# Altium schematic sheet connectors_new.SchDoc
size A4
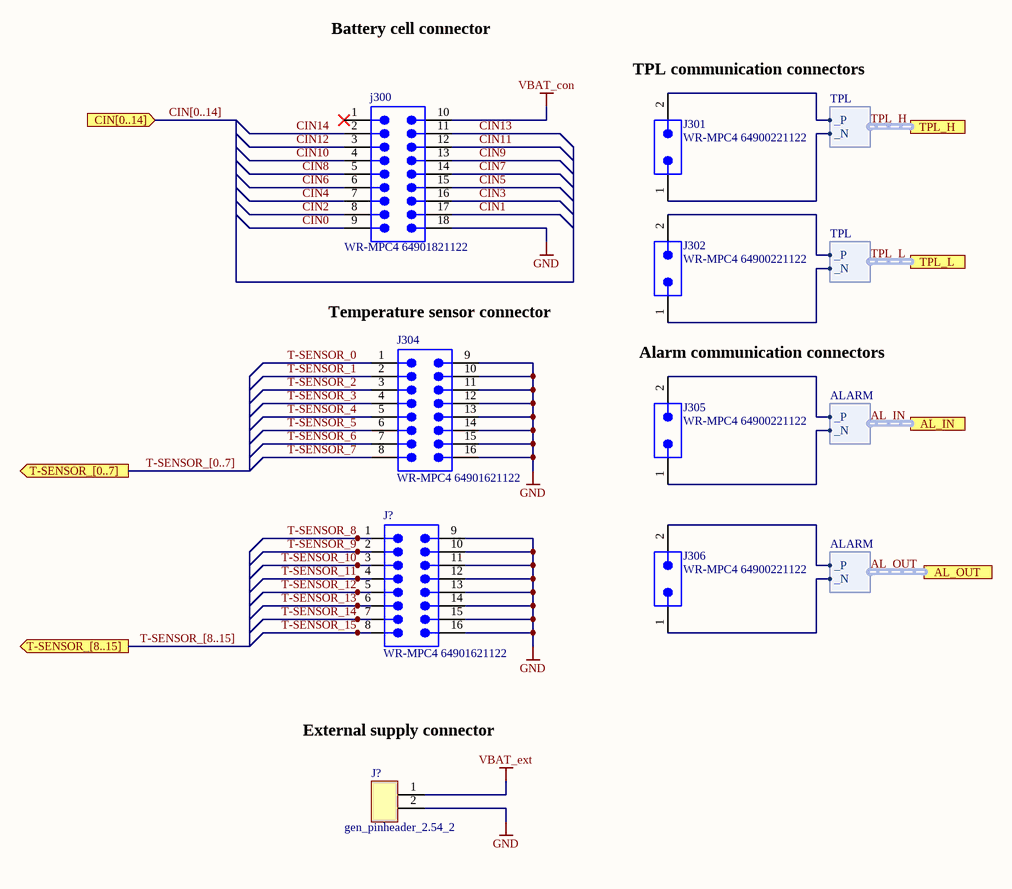
[diagram p0: connectors_new.SchDoc]

## Parts
(Parts that share a designator on the sheet are numbered #1, #2 ... from top to bottom, then left to right.)
j300  WR-MPC4 64901821122  [64901821122]
J301  WR-MPC4 64900221122  [64900221122]
J302  WR-MPC4 64900221122  [64900221122]
J304  WR-MPC4 64901621122  [64901621122]
J305  WR-MPC4 64900221122  [64900221122]
J306  WR-MPC4 64900221122  [64900221122]
J?#1  WR-MPC4 64901621122  [64901621122]
J?#2  gen_pinheader_2.54_2  [Pinheader_2.54_2]

## Ports
AL_IN (harness ALARM), AL_OUT (harness ALARM), CIN[0..14] (in), T-SENSOR_[0..7] (out), T-SENSOR_[8..15] (out), TPL_H (harness TPL), TPL_L (harness TPL)

## Harnesses
TPL: _P, _N
ALARM: _P, _N

## Nets
GND: j300.18 J304.9 J304.10 J304.11 J304.12 J304.13 J304.14 J304.15 J304.16 J?#1.9 J?#1.10 J?#1.11 J?#1.12 J?#1.13 J?#1.14 J?#1.15 J?#1.16 J?#2.2
VBAT_con: j300.10
VBAT_ext: J?#2.1
AL_IN._N: J305.1 ; port AL_IN._N
AL_IN._P: J305.2 ; port AL_IN._P
AL_OUT._N: J306.1 ; port AL_OUT._N
AL_OUT._P: J306.2 ; port AL_OUT._P
CIN0: j300.9
CIN1: j300.17
CIN2: j300.8
CIN3: j300.16
CIN4: j300.7
CIN5: j300.15
CIN6: j300.6
CIN7: j300.14
CIN8: j300.5
CIN9: j300.13
CIN10: j300.4
CIN11: j300.12
CIN12: j300.3
CIN13: j300.11
CIN14: j300.2
T-SENSOR_0: J304.1
T-SENSOR_1: J304.2
T-SENSOR_2: J304.3
T-SENSOR_3: J304.4
T-SENSOR_4: J304.5
T-SENSOR_5: J304.6
T-SENSOR_6: J304.7
T-SENSOR_7: J304.8
T-SENSOR_8: J?#1.1
T-SENSOR_9: J?#1.2
T-SENSOR_10: J?#1.3
T-SENSOR_11: J?#1.4
T-SENSOR_12: J?#1.5
T-SENSOR_13: J?#1.6
T-SENSOR_14: J?#1.7
T-SENSOR_15: J?#1.8
TPL_H._N: J301.1 ; port TPL_H._N
TPL_H._P: J301.2 ; port TPL_H._P
TPL_L._N: J302.1 ; port TPL_L._N
TPL_L._P: J302.2 ; port TPL_L._P

Not connected (* = marked no-connect by the designer): j300 1*

## Buses and harness runs
bus CIN[0..14] = port CIN[0..14]
bus T-SENSOR_[0..7] = port T-SENSOR_[0..7]
bus T-SENSOR_[8..15] = port T-SENSOR_[8..15]
harness AL_IN = port AL_IN
harness AL_OUT = port AL_OUT
harness TPL_H = port TPL_H
harness TPL_L = port TPL_L

## Notes on the sheet
- Battery cell connector
- (near J301) TPL communication connectors
- (near J304) Temperature sensor connector
- Alarm communication connectors
- External supply connector

## Library data of the parts
j300 = CMP-1502-00501-2: NexarPartId: 23024638; Number of Positions: 18; Current Rating: 6A; Gender: Male; Operating Supply Voltage: 600V; Insulation Resistance: 1GΩ; Contact Resistance: 10mΩ; Connector Type: Male Pin, Socket; Row Spacing: 4.191mm; Pitch: 4.2mm; Color: White; Height: 12.8mm; Orientation: Vertical; Width: 39.1mm; Contact Material: Copper; Number of Contacts: 18; Max Operating Temperature: 105°C; Number of Rows: 2; RoHS: Compliant; Min Operating Temperature: -40°C; Contact Plating: Tin; Length: 39mm; Mount: Through Hole; Termination: Solder; Lead Pitch: 4.2mm; REACH SVHC: Unknown; Number of Pins: 18; Fastening Type: Ramp
J301 J302 J305 J306 = CMP-1502-00493-2: NexarPartId: 8917578; Contact Resistance: 10mΩ; Operating Supply Voltage: 600V; Current Rating: 9A; Gender: Male; Number of Contacts: 2; Lead Length: 3.5mm; Connector Type: Male Pin, Socket; Pitch: 4.2mm; Row Spacing: 5.5118mm; Insulation Resistance: 1GΩ; Height: 12.8mm; Max Operating Temperature: 105°C; Color: White; Number of Rows: 2; Voltage Rating: 600V; Termination: Solder; Fastening Type: Ramp; Width: 5.5mm; Min Operating Temperature: -40°C; Length: 5.4mm; Mount: Through Hole; Flammability Rating: UL94 V-0; Contact Gender: Male; Contact Material: Copper; Lead Pitch: 4.2mm; Housing Material: Nylon; Contact Plating: Tin; Number of Pins: 2; RoHS: Compliant; Orientation: Vertical; REACH SVHC: Unknown; Number of Positions: 2
J304 J?#1 = CMP-1502-00500-2: NexarPartId: 23024631; Pitch: 4.2mm; Gender: Male; Row Spacing: 4.191mm; Operating Supply Voltage: 600V; Insulation Resistance: 1GΩ; Connector Type: Male Pin, Socket; Contact Resistance: 10mΩ; Number of Positions: 16; Current Rating: 6A; Fastening Type: Ramp; Lead Pitch: 4.2mm; REACH SVHC: Unknown; Number of Pins: 16; RoHS: Compliant; Color: White; Mount: Through Hole; Contact Material: Copper; Width: 34.9mm; Max Operating Temperature: 105°C; Min Operating Temperature: -40°C; Height: 12.8mm; Termination: Solder; Orientation: Vertical; Length: 34.8mm; Contact Plating: Tin; Number of Rows: 2; Number of Contacts: 16
J?#2 = gen_pinheader_2.54_2: Standard Pinheader, THD, gerade, 2.54mm; Circuits: 2; Rated Voltage: 250V; Rated Current: 3A; Automotive Qualified: False; Part Number: gen_pinheader_2.54_2; Part Name: PinHeader; Operating Temperature: −40 °C - +105 °C; Supplier 1: Farnell; Supplier Part Number 1: 2505044